# Altium schematic sheet e-ink_sch.SchDoc
size A3; PageSetup: Record=PageOptions|CenterHorizontal=True|CenterVertical=True|PrintScale=0.70|XCorrection=1.00|YCorrection=1.00|PrintKind=0|BorderSize=5000000|LeftOffset=0|BottomOffset=0|Orientation=2|PaperLength=1000|PaperWidth=1000|Scale=100|PaperSource=7|PrintQuality=-4|MediaType=1|DitherType=10|PaperKind=A4|PrintScaleMode=0
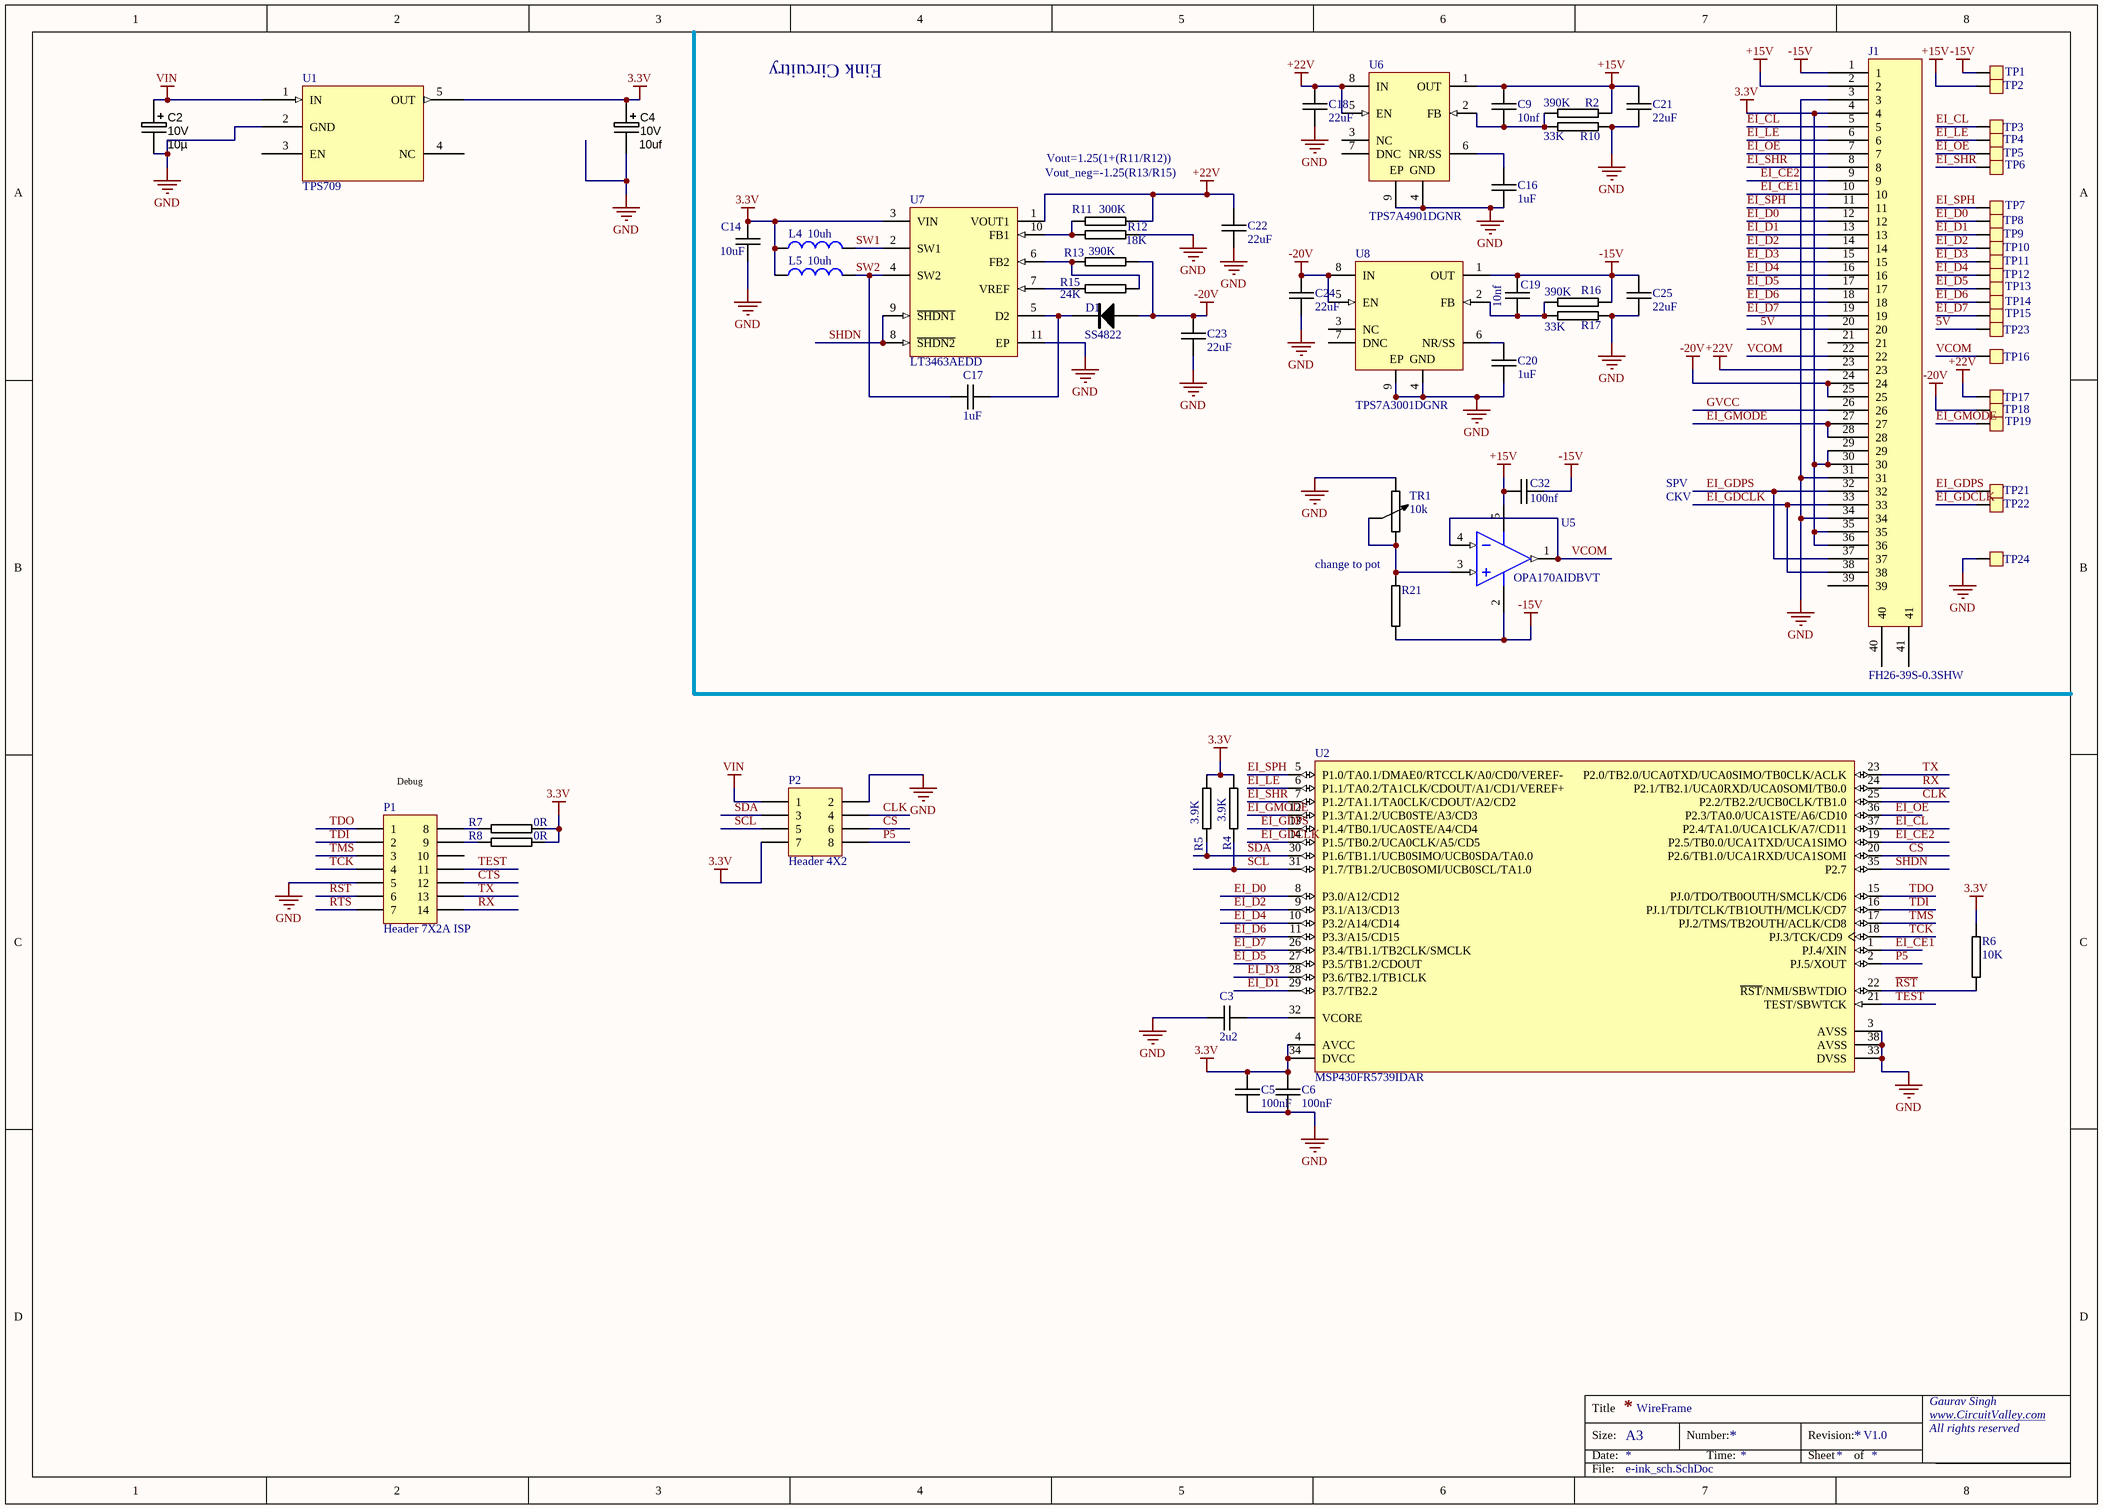
[diagram p0: e-ink_sch.SchDoc]

## Parts
C2  Ratings: 10V  [CAPMP3528X210N]  (hidden comment: 10µ)
C3  2u2  [0805C-GENERIC]
C4  10uf  Ratings: 10V  [CAPMP3528X210N]
C5  100nF  [0603C-GENERIC]
C6  100nF  [0603C-GENERIC]
C9  10nf  [0603C-GENERIC]
C14  10uF  [0603C-GENERIC]
C16  1uF  [0603C-GENERIC]
C17  1uF  [0603C-GENERIC]
C18  22uF  [0603C-GENERIC]
C19  10nf  [0603C-GENERIC]
C20  1uF  [0603C-GENERIC]
C21  22uF  [0603C-GENERIC]
C22  22uF  [0603C-GENERIC]
C23  22uF  [0603C-GENERIC]
C24  22uF  [0603C-GENERIC]
C25  22uF  [0603C-GENERIC]
C32  100nf  [0603C-GENERIC]
D1  SS4822  [DIODE-SMA]
J1  FH26-39S-0.3SHW  [FH26-39S-0.3SHW]
L4  10uh  [IFSC-1515AH-01]
L5  10uh  [IFSC-1515AH-01]
P1  Header 7X2A ISP  [HDR2X7_CEN]
P2  Header 4X2  [HDR2X4]
R2  390K  [0603R-2K2]
R4  3.9K  [0805R-2K2]
R5  3.9K  [0805R-2K2]
R6  10K  [0603R-10K]
R7  0R  [0805R-2K2]
R8  0R  [0805R-2K2]
R10  33K  [0603R-2K2]
R11  300K  [0603R-2K2]
R12  18K  [0603R-2K2]
R13  390K  [0603R-2K2]
R15  24K  [0603R-2K2]
R16  390K  [0603R-2K2]
R17  33K  [0603R-2K2]
R21  unknown  [0603R-2K2]  (value not drawn)
TP1  TEST_POINT  [SMD_TEST_3.5_2.0]  (value not drawn)
TP2  TEST_POINT  [SMD_TEST_3.5_2.0]  (value not drawn)
TP3  TEST_POINT  [SMD_TEST_3.5_2.0]  (value not drawn)
TP4  TEST_POINT  [SMD_TEST_3.5_2.0]  (value not drawn)
TP5  TEST_POINT  [SMD_TEST_3.5_2.0]  (value not drawn)
TP6  TEST_POINT  [SMD_TEST_3.5_2.0]  (value not drawn)
TP7  TEST_POINT  [SMD_TEST_3.5_2.0]  (value not drawn)
TP8  TEST_POINT  [SMD_TEST_3.5_2.0]  (value not drawn)
TP9  TEST_POINT  [SMD_TEST_3.5_2.0]  (value not drawn)
TP10  TEST_POINT  [SMD_TEST_3.5_2.0]  (value not drawn)
TP11  TEST_POINT  [SMD_TEST_3.5_2.0]  (value not drawn)
TP12  TEST_POINT  [SMD_TEST_3.5_2.0]  (value not drawn)
TP13  TEST_POINT  [SMD_TEST_3.5_2.0]  (value not drawn)
TP14  TEST_POINT  [SMD_TEST_3.5_2.0]  (value not drawn)
TP15  TEST_POINT  [SMD_TEST_3.5_2.0]  (value not drawn)
TP16  TEST_POINT  [SMD_TEST_3.5_2.0]  (value not drawn)
TP17  TEST_POINT  [SMD_TEST_3.5_2.0]  (value not drawn)
TP18  TEST_POINT  [SMD_TEST_3.5_2.0]  (value not drawn)
TP19  TEST_POINT  [SMD_TEST_3.5_2.0]  (value not drawn)
TP21  TEST_POINT  [SMD_TEST_3.5_2.0]  (value not drawn)
TP22  TEST_POINT  [SMD_TEST_3.5_2.0]  (value not drawn)
TP23  TEST_POINT  [SMD_TEST_3.5_2.0]  (value not drawn)
TP24  TEST_POINT  [SMD_TEST_3.5_2.0]  (value not drawn)
TR1  10k  [SMDPOT]
U1  TPS709  [SOT23-5]
U2  MSP430FR5739IDAR  [TI-DA38_N]
U5  OPA170AIDBVT  [TI-DBV5_N]
U6  TPS7A4901DGNR  [TI-DGN8-1760X1425TP_N]
U7  LT3463AEDD  [LT-DD-10_V]
U8  TPS7A3001DGNR  [TI-DGN8-1760X1425TP_N]

## Nets
3.3V: C4.1 C5.1 C6.1 C14.2 J1.4 J1.29 J1.30 J1.35 J1.36 L4.1 L5.1 P2.7 R4.2 R5.2 R6.1 R7.1 R8.1 U1.5(OUT) U2.4(AVCC) U2.34(DVCC) U7.3(VIN)
+15V: C9.1 C21.2 C32.2 J1.2 R2.2 TP2.0 U5.5(V+) U6.1(OUT)
+22V: C18.2 C22.2 J1.23 R11.2 TP17.0 U6.5(EN) U6.8(IN) U7.1(VOUT1)
-15V: C19.1 C25.2 C32.1 J1.1 R16.2 R21.1 TP1.0 U5.2(V-) U8.1(OUT)
-20V: C23.2 C24.2 D1.A J1.24 J1.25 R13.2 TP18.0 U8.5(EN) U8.8(IN)
GND: C2.2 C3.1 C4.2 C5.2 C6.2 C14.1 C16.1 C18.1 C20.2 C21.1 C22.1 C23.1 C24.1 C25.1 J1.3 J1.31 J1.34 P1.5 P2.2 R10.2 R12.1 R17.2 TP24.0 TR1.2 U1.2(GND) U2.3(AVSS) U2.33(DVSS) U2.38(AVSS) U6.4(GND) U6.9(EP) U7.11(EP) U8.4(GND) U8.9(EP)
VIN: C2.1 P2.1 U1.1(IN)
5V: J1.20 TP23.0
CLK: P2.4 U2.25(P2.2/TB2.2/UCB0CLK/TB1.0)
CS: P2.6 U2.20(P2.6/TB1.0/UCA1RXD/UCA1SOMI)
CTS: P1.12
EI_CE1: J1.10 U2.1(PJ.4/XIN)
EI_CE2: J1.9 U2.19(P2.5/TB0.0/UCA1TXD/UCA1SIMO)
EI_CL: J1.5 TP3.0 U2.37(P2.4/TA1.0/UCA1CLK/A7/CD11)
EI_D0: J1.12 TP8.0 U2.8(P3.0/A12/CD12)
EI_D1: J1.13 TP9.0 U2.29(P3.7/TB2.2)
EI_D2: J1.14 TP10.0 U2.9(P3.1/A13/CD13)
EI_D3: J1.15 TP11.0 U2.28(P3.6/TB2.1/TB1CLK)
EI_D4: J1.16 TP12.0 U2.10(P3.2/A14/CD14)
EI_D5: J1.17 TP13.0 U2.27(P3.5/TB1.2/CDOUT)
EI_D6: J1.18 TP14.0 U2.11(P3.3/A15/CD15)
EI_D7: J1.19 TP15.0 U2.26(P3.4/TB1.1/TB2CLK/SMCLK)
EI_GDCLK: J1.33 J1.38 TP22.0 U2.14(P1.5/TB0.2/UCA0CLK/A5/CD5)
EI_GDPS: J1.32 J1.37 TP21.0 U2.13(P1.4/TB0.1/UCA0STE/A4/CD4)
EI_GMODE: J1.27 J1.28 TP19.0 U2.12(P1.3/TA1.2/UCB0STE/A3/CD3)
EI_LE: J1.6 TP4.0 U2.6(P1.1/TA0.2/TA1CLK/CDOUT/A1/CD1/VEREF+)
EI_OE: J1.7 TP5.0 U2.36(P2.3/TA0.0/UCA1STE/A6/CD10)
EI_SHR: J1.8 TP6.0 U2.7(P1.2/TA1.1/TA0CLK/CDOUT/A2/CD2)
EI_SPH: J1.11 TP7.0 U2.5(P1.0/TA0.1/DMAE0/RTCCLK/A0/CD0/VEREF-)
GVCC: J1.26
P5: P2.8 U2.2(PJ.5/XOUT)
~{RST}: P1.6 R6.2 U2.22(~{RST}/NMI/SBWTDIO)
RTS: P1.7
RX: P1.14 U2.24(P2.1/TB2.1/UCA0RXD/UCA0SOMI/TB0.0)
SCL: P2.5 R4.1 U2.31(P1.7/TB1.2/UCB0SOMI/UCB0SCL/TA1.0)
SDA: P2.3 R5.1 U2.30(P1.6/TB1.1/UCB0SIMO/UCB0SDA/TA0.0)
SHDN: U2.35(P2.7) U7.8(~{SHDN2}) U7.9(~{SHDN1})
SW1: L4.2 U7.2(SW1)
SW2: C17.2 L5.2 U7.4(SW2)
TCK: P1.4 U2.18(PJ.3/TCK/CD9)
TDI: P1.2 U2.16(PJ.1/TDI/TCLK/TB1OUTH/MCLK/CD7)
TDO: P1.1 U2.15(PJ.0/TDO/TB0OUTH/SMCLK/CD6)
TEST: P1.11 U2.21(TEST/SBWTCK)
TMS: P1.3 U2.17(PJ.2/TMS/TB2OUTH/ACLK/CD8)
TX: P1.13 U2.23(P2.0/TB2.0/UCA0TXD/UCA0SIMO/TB0CLK/ACLK)
VCOM: J1.22 TP16.0 U5.1(OUT) U5.4(IN-)
NetC3_2: C3.2 U2.32(VCORE)
NetC9_2: C9.2 R2.1 R10.1 U6.2(FB)
NetC16_2: C16.2 U6.6(NR/SS)
NetC17_1: C17.1 D1.K U7.5(D2)
NetC19_2: C19.2 R16.1 R17.1 U8.2(FB)
NetC20_1: C20.1 U8.6(NR/SS)
NetP1_8: P1.8 R7.2
NetP1_9: P1.9 R8.2
NetR11_1: R11.1 R12.2 U7.10(FB1)
NetR13_1: R13.1 R15.2 U7.6(FB2)
NetR15_1: R15.1 U7.7(VREF)
NetR21_2: R21.2 TR1.1 TR1.W U5.3(IN+)

Not connected (* = marked no-connect by the designer): J1 21 39 40 41; P1 10; U1 3(EN) 4(NC); U6 3(NC) 7(DNC); U8 3(NC) 7(DNC)

## Notes on the sheet
- Eink Circuitry
- Vout_neg=-1.25(R13/R15)
- Vout=1.25(1+(R11/R12))
- CKV
- SPV
- (near R21) change to pot
- (near P1) Debug
- WireFrame
- V1.0
- Title
- Size:
- Date:
- A3
- Number:
- Time:
- Revision:
- Sheet
- of
- Gaurav Singh
- www.CircuitValley.com
- All rights reserved
- File:

## Library data of the parts
C2 = CAPT_47u_1210_6V3: Capacitor SMD Tantalum 47uF 20% 6.3V 1210; Manufacturer 1: AVX Corporation; Manufacturer Part Number 1: TCJB476M006R0070; Manufacturer Size Code: B; ESR (Equivalent Series Resistance): 70.0 mOhm; Type: Molded; Package / Case: 1210 (3528 Metric); Tolerance: ±20%; Material: Tantalum; Supplier 1: Digi-Key; Supplier Part Number 1: 478-3139-1-ND; Voltage - Rated: 10V; Operating Temperature: -55°C ~ 125°C; Size / Dimension: 0.138" L x 0.110" W (3.50mm x 2.80mm); Height - Seated (Max): 0.083" (2.10mm); ComponentLink1URL: http://www.avx.com/docs/Catalogs/tcj.pdf; ComponentLink1Description: http://www.avx.com/docs/Catalogs/tcj.pdf; Value: 10µ
C3 = 0805C-2U2-6V3-X5R-PAN: CAPACITOR 0805 CERAMIC; Manufacturer Part Number: ECJ-1VB0J225K; Manufacturer: Panasonic - ECG; Reel: C7; Supplier 1: Digi-Key; Supplier Part Number 1: PCC2273TR-ND
C4 = CAPT_47u_1210_6V3: Capacitor SMD Tantalum 47uF 20% 6.3V 1210; Manufacturer 1: AVX Corporation; Manufacturer Part Number 1: TCJB476M006R0070; Manufacturer Size Code: B; ESR (Equivalent Series Resistance): 70.0 mOhm; Type: Molded; Value: 47µ; Package / Case: 1210 (3528 Metric); Tolerance: ±20%; Material: Tantalum; Supplier 1: Digi-Key; Supplier Part Number 1: 478-3139-1-ND; Voltage - Rated: 10V; Operating Temperature: -55°C ~ 125°C; Size / Dimension: 0.138" L x 0.110" W (3.50mm x 2.80mm); Height - Seated (Max): 0.083" (2.10mm); ComponentLink1URL: http://www.avx.com/docs/Catalogs/tcj.pdf; ComponentLink1Description: http://www.avx.com/docs/Catalogs/tcj.pdf
C5 C6 = 0603C-100NF-25V-X7R-TDK: CAPACITOR 0603 CERAMIC; Manufacturer Part Number: C1608X7R1E104K; Manufacturer: TDK Corporation; Reel: C12; Supplier 1: Digi-Key; Supplier Part Number 1: 445-1316-2-ND
C9 C14 C16-C25 C32 = 0603C-10UF-6V3-X5R-MUR: CAPACITOR 0603 CERAMIC; Manufacturer: Murata Electronics North America; Manufacturer Part Number: GRM188R60J106ME47D; Reel: C24; Supplier 1: Digi-Key; Supplier Part Number 1: 490-3896-2-ND
D1 = MBRS140: DIODE; Supplier 1: Digi-Key; Supplier Part Number 1: MBRS140FSTR-ND
L4 L5 = inductor_smd: PartNumber: IFSC1515AHER100M01
P1 = Header 7X2A: Header, 7-Pin, Dual row; LatestRevisionDate: 17-Jul-2002; LatestRevisionNote: Re-released for DXP Platform.; Publisher: Altium Limited
P2 = Header 4X2: Header, 4-Pin, Dual row; LatestRevisionDate: 17-Jul-2002; LatestRevisionNote: Re-released for DXP Platform.; Publisher: Altium Limited
R2 R10-R13 R15-R17 R21 = 0603R-2K2: GENERIC RESISTOR 0603; Manufacturer Part Number: RMC 1/16 2.2K 1% R; Manufacturer: Stackpole Electronics Inc; REEL: R88; Supplier 1: Digi-Key; Supplier Part Number 1: RMCF0603FT2K20TR-ND
R4 R5 R7 R8 = 0805R-2K2: RESISTOR 0805 1/4 WATT THIN FILM; Reel: *
R6 = 0603R-10K: GENERIC RESISTOR 0603; Manufacturer: Stackpole Electronics Inc; Manufacturer Part Number: RMCF 1/16 10K 1% R; Tolerance: ±1%; Power (Watts): 0.1W, 1/10W; Temperature Coefficient: ±100ppm/°C; Resistance In Ohms: 10.0K; Reel: R21; Category: Resistors; Supplier Part Number: RMCF1/1610KFRDKR-ND; Lead Style: Surface Mount (SMD - SMT); RoHS: RoHS Compliant; Packaging: Digi-Reel®; Case: 0603 (1608 metric); Composition: Thick Film; Supplier: Digi-Key; Supplier 1: Digi-Key; Supplier Part Number 1: RMCF0603FT10K0DKR-ND
TR1 = R-TRIM-SMD-10k: GENERIC SMD TRIMMER; Manufacturer Part Number: 3224X-1-103E; Manufacturer: Bourns Inc.; Tolerance: ±10%; Power (Watts): 0.25W, 1/4W; Adjustment Type: Top Adjustment; Resistive Material: Cermet; Resistance In Ohms: 10.0K; Temperature Coefficient: ±100ppm/°C; Number of Turns: 11; Supplier 1: Digi-Key; Supplier Part Number 1: 3224X-1-103ETR-ND; Supplier: Digi-Key; Category: Potentiometers, Variable Resistors; Supplier Part Number: 3224X-1-103ETR-ND; Package / Case: Square - 0.190" L x 0.139" W x 0.200" H (4.80mm x 3.50mm x 5.10mm); Mounting Type: Surface Mount; RoHS: RoHS Compliant; Taper: -; Packaging: Tape & Reel (TR)
U2 = MSP430FR5739IDAR: 24 MHz Mixed Signal Microcontroller, 1024 B SRAM and 33 GPIOs, -40 to 85 degC, 38-pin SOP (DA), Green (RoHS & no Sb/Br); Manufacturer: Texas Instruments; ADC: 10-bit SAR; ADC Channels: 14; Brown Out Reset: Yes; DMA: 3; FRAM(KB): 16; Frequency(MHz): 24; GPIO: 33; Multiplier: 32x32; SRAM(B): 1024; SubFamily: FRAM Series; Timers - 16-bit: 5; USCI_A (UART/LIN/IrDA/SPI): 2; USCI_B (I2C & SPI): 1; DatasheetVersion: SLAS639D; PackageVersion: 4040066/F; PackageReference: DA38; PackageDescription: 38-Pin Plastic Small-Outline Package, Body 6.10 x 12.50 mm, Pitch 0.65 mm; Supplier 1: Digi-Key; Supplier Part Number 1: MSP430FR5739IDA-ND; Supplier 2: Farnell; Supplier Part Number 2: 2148662; Supplier 3: Newark; Supplier Part Number 3: 28W4632; Supplier 4: Newark; Supplier Part Number 4: 87T1098; Supplier 5: Mouser; Supplier Part Number 5: 595-MSP430FR5739IDA; Comparators: Yes; Eco-Plan: Green (RoHS & no Sb/Br); Real-Time Clock: Yes; SVS: Yes; Watchdog: Yes; Mounting Technology: Surface Mount; Code_JEDEC: MO-153; PartNumber: MSP430FR5739IDAR; ComponentLink1Description: Manufacturer URL; ComponentLink1URL: http://www.ti.com/; ComponentLink2Description: Datasheet; ComponentLink2URL: http://www.ti.com/general/docs/lit/getliterature.tsp?genericPartNumber=MSP430FR5739&fileType=pdf; ComponentLink3Description: Package Specification; ComponentLink3URL: http://www.ti.com/lit/ml/mtss002e/mtss002e.pdf
U5 = OPA244NA/250: MicroPower Single-Supply Operational Amplifier MicroAmplifier(TM) Series, 2.2 to 36 V, -40 to 85 degC, 5-pin SOT23 (DBV5), Green (RoHS & no Sb/Br); Manufacturer: Texas Instruments; CMRR(Min)(dB): 84; GBW(Typ)(MHz): 0.43; IIB(Max)(pA): 25000; Iq per channel(Max)(mA): 0.06; Number of Channels: 1; Offset Drift(Typ)(uV/C): 4; Packing: SMALL T&R; Rating: Catalog; Slew Rate(Typ)(V/us): 0.1; Sub Family: High Supply Voltage Amplifier (>=30V), Low Power Amp (<=500uA), Low Supply Voltage Amplifier (<=2.7V), Precision Amplifier; Total Supply Voltage(Max)(+5V is 5, +/-5V is 10): 36; Total Supply Voltage(Min)(+5V is 5, +/-5V is 10): 2.2; Vio (25C)(Max)(mV): 1.5; DatasheetVersion: SBOS088; PackageVersion: 4073253-4/K, 03/2006; PackageReference: DBV5; PackageDescription: 5-Pin Plastic Small Outline, Body 1.6 x 2.9 mm, Pitch 0.95 mm; Supplier 1: Digi-Key; Supplier Part Number 1: OPA244NATR-ND; Supplier 2: Digi-Key; Supplier Part Number 2: OPA244NACT-ND; Supplier 3: Digi-Key; Supplier Part Number 3: OPA244NADKR-ND; Supplier 4: Farnell; Supplier Part Number 4: 4413477; Supplier 5: Newark; Supplier Part Number 5: 35C1876; Supplier 6: Mouser; Supplier Part Number 6: 595-OPA244NA/250; Eco-Plan: Green (RoHS & no Sb/Br); Mounting Technology: Surface Mount; Code_JEDEC: MO-178; PartNumber: OPA170AIDBVT; ComponentLink1Description: Manufacturer URL; ComponentLink1URL: http://www.ti.com/; ComponentLink2Description: Datasheet; ComponentLink2URL: http://www.ti.com/lit/ds/symlink/opa244.pdf; ComponentLink3Description: Package Specification; ComponentLink3URL: http://www.ti.com/litv/pdf/mpds018i
U6 = TPS7A4901DGNR: Single Output High PSRR LDO, 150 mA, Adjustable 1.2 to 33 V Output, 3 to 36 V Input, with Ultra-Low Noise, 8-pin MSOP (DGN), -40 to 125 degC, Green (RoHS & no Sb/Br); Manufacturer: Texas Instruments; Accuracy(%): 1.5; Iout(Max)(A): 0.15; Iq(Typ)(mA): 0.06; Power Good: TRUE; SubFamily: Single Channel LDO; Vdo(Typ)(mV): 260; Vin(Max)(V): 36; Vin(Min)(V): 3; Vout Adj(Max)(V): 33; Vout Adj(Min)(V): 1.2; DatasheetVersion: SBVS121B; PackageVersion: 4073271/F; PackageReference: DGN8-1760X1425TP; PackageDescription: 8-pin Plastic Small Outline, Body 3 x 3 mm, Pitch 0.65 mm; Supplier 1: Digi-Key; Supplier Part Number 1: 296-27751-2-ND; Supplier 2: Digi-Key; Supplier Part Number 2: 296-27751-1-ND; Supplier 3: Digi-Key; Supplier Part Number 3: 296-27751-6-ND; Supplier 4: Newark; Supplier Part Number 4: 01T0879; Supplier 5: Mouser; Supplier Part Number 5: 595-TPS7A4901DGNR; Eco-Plan: Green (RoHS & no Sb/Br); Mounting Technology: Surface Mount; Code_JEDEC: MO-187; PartNumber: TPS7A4901DGNR; ComponentLink1Description: Manufacturer URL; ComponentLink1URL: http://www.ti.com/; ComponentLink2Description: Datasheet; ComponentLink2URL: http://www.ti.com/general/docs/lit/getliterature.tsp?genericPartNumber=TPS7A4901&fileType=pdf; ComponentLink3Description: Package Specification; ComponentLink3URL: http://www.ti.com/litv/pdf/mpds046e
U7 = LT3463AEDD: Dual Micropower DC/DC Converters with Schottky Diodes, 2.4 to 15 V Vin, 10-pin SON (DD-10), -40 to 85 degC; Manufacturer: Linear Technology; Number of Outputs: 2; Vin Max(V): 15; Vin Min(V): 2.4; PackageVersion: Rev. C, 06/2010; PackageReference: DD-10; PackageDescription: 10-Pin Plastic DFN, Body 3 x 3 mm, Pitch 0.5 mm; Supplier 1: Digi-Key; Supplier Part Number 1: LT3463AEDD-ND; RoHS: FALSE; Mounting Technology: Surface Mount; Code_JEDEC: MO-229; PartNumber: LT3463AEDD; ComponentLink1Description: Manufacturer URL; ComponentLink1URL: http://www.linear.com/; ComponentLink2Description: Datasheet; ComponentLink2URL: http://cds.linear.com/docs/en/datasheet/3463f.pdf; ComponentLink3Description: Package Specification; ComponentLink3URL: http://cds.linear.com/docs/en/packaging/DFN_10_05-08-1699.pdf
U8 = TPS7A3001DGNR: Single Output High PSRR LDO, 200 mA, Adjustable -1.18 to -33 V Output, -3 to -36 V Input, with Ultra-Low Noise, 8-pin MSOP (DGN), -40 to 125 degC, Green (RoHS & no Sb/Br); Manufacturer: Texas Instruments; Accuracy(%): 1.5; Iout(Max)(A): 0.2; Iq(Typ)(mA): 0.05; SubFamily: Single Channel LDO; Vdo(Typ)(mV): 216; DatasheetVersion: SBVS125A; PackageVersion: 4073271/F; PackageReference: DGN8-1760X1425TP; PackageDescription: 8-pin Plastic Small Outline, Body 3 x 3 mm, Pitch 0.65 mm; Supplier 1: Digi-Key; Supplier Part Number 1: 296-27750-2-ND; Supplier 2: Digi-Key; Supplier Part Number 2: 296-27750-1-ND; Supplier 3: Digi-Key; Supplier Part Number 3: 296-27750-6-ND; Supplier 4: Newark; Supplier Part Number 4: 01T0878; Supplier 5: Mouser; Supplier Part Number 5: 595-TPS7A3001DGNR; Eco-Plan: Green (RoHS & no Sb/Br); Vin(Max)(V): -36; Vin(Min)(V): -3; Vout Adj(Max)(V): -33; Vout Adj(Min)(V): -1.18; Mounting Technology: Surface Mount; Code_JEDEC: MO-187; PartNumber: TPS7A3001DGNR; ComponentLink1Description: Manufacturer URL; ComponentLink1URL: http://www.ti.com/; ComponentLink2Description: Datasheet; ComponentLink2URL: http://www.ti.com/general/docs/lit/getliterature.tsp?genericPartNumber=TPS7A3001&fileType=pdf; ComponentLink3Description: Package Specification; ComponentLink3URL: http://www.ti.com/litv/pdf/mpds046e